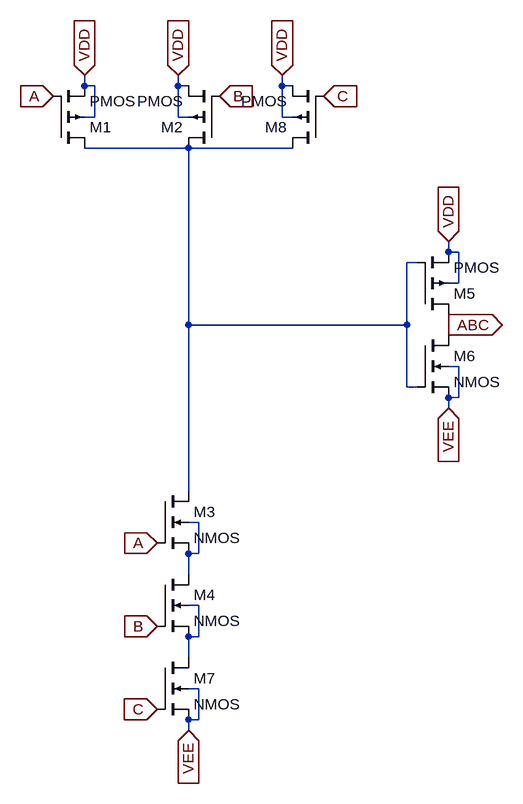
[diagram p0: schematic 3_Input_AND_Gate_Symbol.asc]
3_Input_AND_Gate_Symbol.asc, the LTspice schematic file:
Version 4
SHEET 1 1304 1144
WIRE 368 64 368 48
WIRE 384 64 368 64
WIRE 512 64 512 48
WIRE 528 64 512 64
WIRE 672 64 672 48
WIRE 688 64 672 64
WIRE 384 112 384 64
WIRE 384 112 368 112
WIRE 512 112 512 64
WIRE 528 112 512 112
WIRE 672 112 672 64
WIRE 688 112 672 112
WIRE 528 160 368 160
WIRE 688 160 528 160
WIRE 928 320 928 304
WIRE 944 320 928 320
WIRE 880 336 864 336
WIRE 944 368 944 320
WIRE 944 368 928 368
WIRE 528 432 528 160
WIRE 864 432 864 336
WIRE 864 432 528 432
WIRE 928 432 928 416
WIRE 928 448 928 432
WIRE 944 496 928 496
WIRE 864 528 864 432
WIRE 880 528 864 528
WIRE 944 544 944 496
WIRE 944 544 928 544
WIRE 928 560 928 544
WIRE 528 688 528 432
WIRE 544 736 528 736
WIRE 544 784 544 736
WIRE 544 784 528 784
WIRE 528 816 528 784
WIRE 544 864 528 864
WIRE 544 912 544 864
WIRE 544 912 528 912
WIRE 528 944 528 912
WIRE 544 992 528 992
WIRE 544 1040 544 992
WIRE 544 1040 528 1040
WIRE 528 1056 528 1040
FLAG 928 432 ABC
IOPIN 928 432 Out
FLAG 320 80 A
IOPIN 320 80 In
FLAG 480 768 A
IOPIN 480 768 In
FLAG 576 80 B
IOPIN 576 80 In
FLAG 480 896 B
IOPIN 480 896 In
FLAG 368 48 VDD
IOPIN 368 48 In
FLAG 512 48 VDD
IOPIN 512 48 In
FLAG 928 304 VDD
IOPIN 928 304 In
FLAG 528 1056 VEE
IOPIN 528 1056 In
FLAG 928 560 VEE
IOPIN 928 560 In
FLAG 480 1024 C
IOPIN 480 1024 In
FLAG 736 80 C
IOPIN 736 80 In
FLAG 672 48 VDD
IOPIN 672 48 In
SYMBOL pmos4 320 160 M180
SYMATTR InstName M1
SYMBOL pmos4 576 160 R180
SYMATTR InstName M2
SYMBOL nmos4 480 688 R0
SYMATTR InstName M3
SYMBOL nmos4 480 816 R0
SYMATTR InstName M4
SYMBOL pmos4 880 416 M180
SYMATTR InstName M5
SYMBOL nmos4 880 448 R0
SYMATTR InstName M6
SYMBOL nmos4 480 944 R0
SYMATTR InstName M7
SYMBOL pmos4 736 160 R180
SYMATTR InstName M8

The netlist it stands for:
* 3_Input_AND_Gate_Symbol.asc
M1 N001 A VDD VDD PMOS
M2 N001 B VDD VDD PMOS
M3 N001 A N002 N002 NMOS
M4 N002 B N003 N003 NMOS
M5 ABC N001 VDD VDD PMOS
M6 ABC N001 VEE VEE NMOS
M7 N003 C VEE VEE NMOS
M8 N001 C VDD VDD PMOS
.model NMOS NMOS
.model PMOS PMOS
.lib standard.mos
.backanno
.end